# Altium schematic sheet PositionMeasurement.SchDoc: MSE - CSYEI : Position measurement
size A4; Author: BKO + PKI; SheetNumber: 6; SheetTotal: 8; SVN: OUI; Version: 2.1; NoProject: <no>; TitleProject: <project>
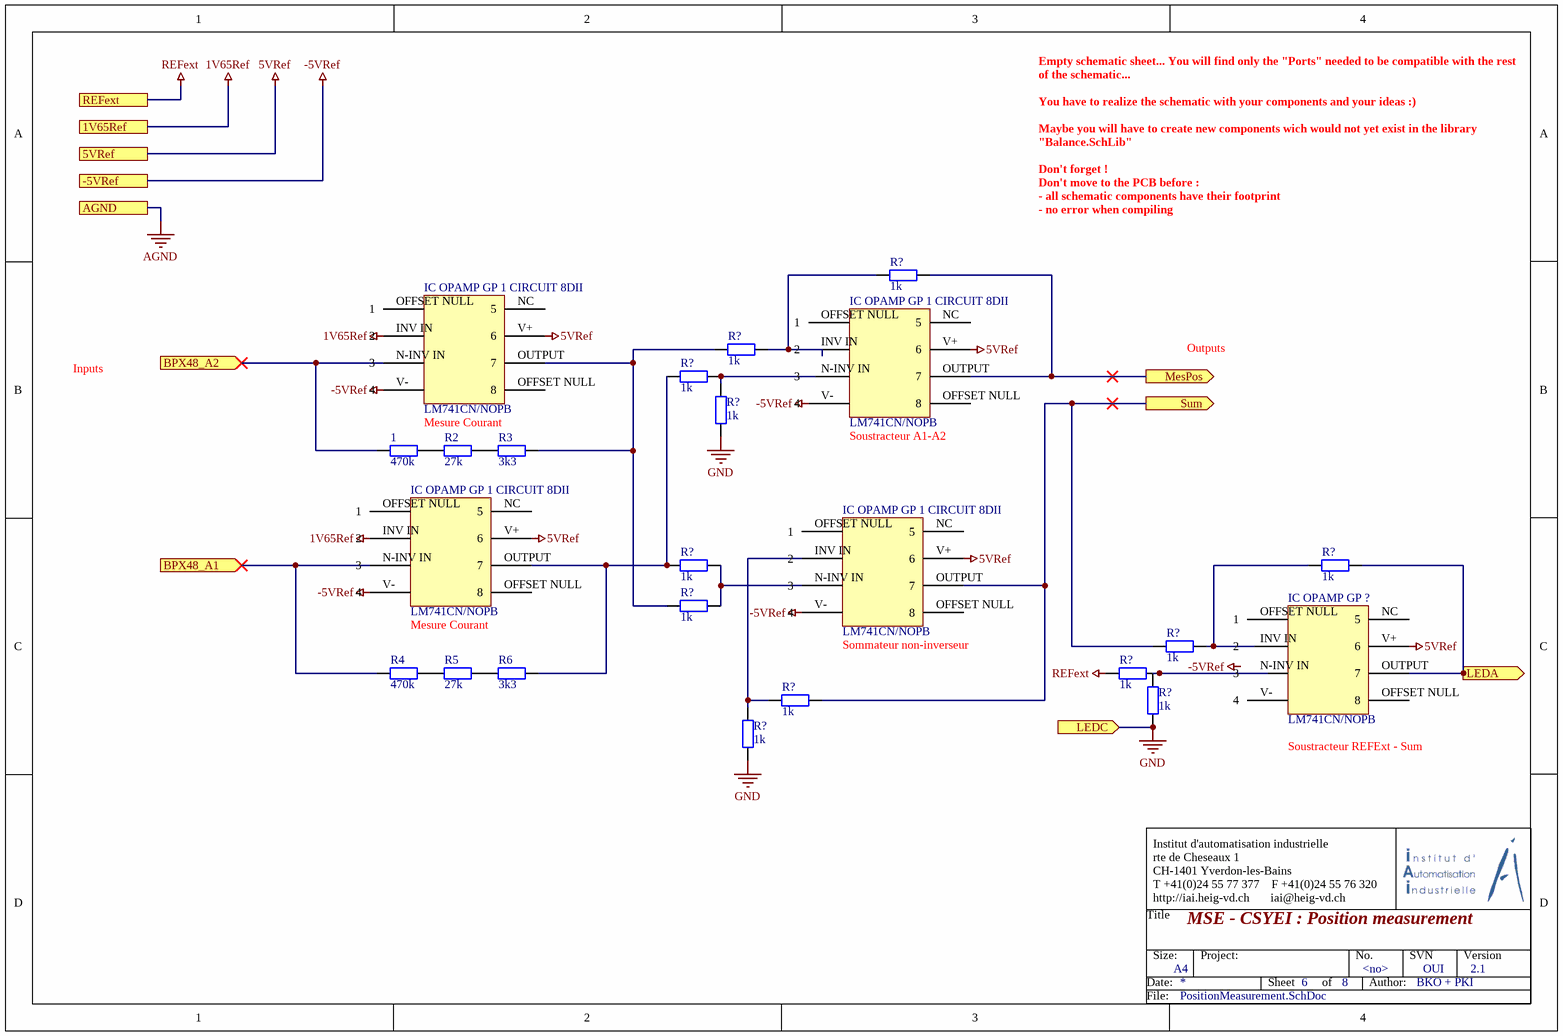
[diagram p0: PositionMeasurement.SchDoc]

## Parts
(Parts that share a designator on the sheet are numbered #1, #2 ... from top to bottom, then left to right.)
1  470k  [RESC2012N]
IC_OPAMP_GP_1_CIRCUIT_8DII#1  LM741CN/NOPB
IC_OPAMP_GP_1_CIRCUIT_8DII#2  LM741CN/NOPB
IC_OPAMP_GP_1_CIRCUIT_8DII#3  LM741CN/NOPB
IC_OPAMP_GP_1_CIRCUIT_8DII#4  LM741CN/NOPB
IC_OPAMP_GP_?  LM741CN/NOPB
R2  27k  [RESC2012N]
R3  3k3  [RESC2012N]
R4  470k  [RESC2012N]
R5  27k  [RESC2012N]
R6  3k3  [RESC2012N]
R?#1  1k  [RESC2012N]
R?#2  1k  [RESC2012N]
R?#3  1k  [RESC2012N]
R?#4  1k  [RESC2012N]
R?#5  1k  [RESC2012N]
R?#6  1k  [RESC2012N]
R?#7  1k  [RESC2012N]
R?#8  1k  [RESC2012N]
R?#9  1k  [RESC2012N]
R?#10  1k  [RESC2012N]
R?#11  1k  [RESC2012N]
R?#12  1k  [RESC2012N]

## Ports
1V65Ref, 5VRef, -5VRef, AGND, BPX48_A1 (in), BPX48_A2 (in), LEDA (out), LEDC (in), MesPos (out), REFext, Sum (out)

## Nets
1V65Ref: port 1V65Ref
5VRef: IC_OPAMP_GP_1_CIRCUIT_8DII#1.V+(6) IC_OPAMP_GP_1_CIRCUIT_8DII#2.V+(6) IC_OPAMP_GP_1_CIRCUIT_8DII#3.V+(6) IC_OPAMP_GP_1_CIRCUIT_8DII#4.V+(6) IC_OPAMP_GP_?.V+(6) ; port 5VRef
-5VRef: port -5VRef
AGND: port AGND
GND: R?#4.1 R?#11.1 R?#12.1 ; port LEDC
REFext: R?#9.1 ; port REFext
BPX48_A1: R4.1 ; port BPX48_A1
BPX48_A2: 1.1 ; port BPX48_A2
LEDA: IC_OPAMP_GP_?.OUTPUT(7) R?#5.2 ; port LEDA
MesPos: IC_OPAMP_GP_1_CIRCUIT_8DII#2.OUTPUT(7) R?#1.2 ; port MesPos
Sum: IC_OPAMP_GP_1_CIRCUIT_8DII#4.OUTPUT(7) R?#8.1 R?#10.1 ; port Sum
Net1_2: 1.2 R2.1
NetIC_OPAMP_GP_1_CIRCUIT_8DII#1_OUTPUT: IC_OPAMP_GP_1_CIRCUIT_8DII#1.OUTPUT(7) R3.2 R?#2.1 R?#7.2
NetIC_OPAMP_GP_1_CIRCUIT_8DII#3_OUTPUT: IC_OPAMP_GP_1_CIRCUIT_8DII#3.OUTPUT(7) R6.2 R?#3.1 R?#6.2
NetR2_2: R2.2 R3.1
NetR4_2: R4.2 R5.1
NetR5_2: R5.2 R6.1
NetR?#1_1: R?#1.1 R?#2.2
NetR?#3_2: R?#3.2 R?#4.2
NetR?#5_1: R?#5.1 R?#8.2
NetR?#6_1: R?#6.1 R?#7.1
NetR?#9_2: R?#9.2 R?#11.2
NetR?#10_2: R?#10.2 R?#12.2

Not connected (* = marked no-connect by the designer): IC_OPAMP_GP_1_CIRCUIT_8DII#1 INV IN(2) N-INV IN(3) NC(5) OFFSET NULL(1) V-(4); IC_OPAMP_GP_1_CIRCUIT_8DII#2 INV IN(2) N-INV IN(3) NC(5) OFFSET NULL(1) V-(4); IC_OPAMP_GP_1_CIRCUIT_8DII#3 INV IN(2) N-INV IN(3) NC(5) OFFSET NULL(1) V-(4); IC_OPAMP_GP_1_CIRCUIT_8DII#4 INV IN(2) N-INV IN(3) NC(5) OFFSET NULL(1) V-(4); IC_OPAMP_GP_? INV IN(2) N-INV IN(3) NC(5) OFFSET NULL(1) V-(4)

## Notes on the sheet
- Empty schematic sheet... You will find only the "Ports" needed to be compatible with the rest of the schematic...
  You have to realize the schematic with your components and your ideas :)
  Maybe you will have to create new components wich would not yet exist in the library "Balance.SchLib"
  Don't forget !
  Don't move to the PCB before :
  - all schematic components have their footprint
  - no error when compiling
- Inputs
- Outputs
- Mesure Courant
- (near IC_OPAMP_GP_1_CIRCUIT_8DII#2) Soustracteur A1-A2
- (near IC_OPAMP_GP_1_CIRCUIT_8DII#4) Sommateur non-inverseur
- (near IC_OPAMP_GP_?) Soustracteur REFExt - Sum
- Labels drawn without touching a wire or pin: 1V65Ref, -5VRef
- Title
- Institut d'automatisation industrielle
  rte de Cheseaux 1
  CH-1401 Yverdon-les-Bains
  T +41(0)24 55 77 377    F +41(0)24 55 76 320
  http://iai.heig-vd.ch       iai@heig-vd.ch
- Date:
- Size:
- A4
- Project:
- Sheet
- of
- No.
- Author:
- SVN
- Version
- File:

## Library data of the parts
1 R4 = Res_470k: Resistor; Value: 470k; Supplier 1: Digi-Key; Supplier Part Number 1: 311-470KCRCT-ND
IC_OPAMP_GP_1_CIRCUIT_8DII#1-IC_OPAMP_GP_1_CIRCUIT_8DII#4 IC_OPAMP_GP_? = LM741CN/NOPB: IC OPAMP GP 1 CIRCUIT 8DII; Supplier 1: Digi-Key; Supplier Part Number 1: LM741CNNS/NOPB-ND
R2 R5 = Res_27k: Resistor; Value: 27k; Supplier 1: Digi-Key; Supplier Part Number 1: 311-27.0KCRCT-ND
R3 R6 = Res_3k3: Resistor; Value: 3k3; Supplier 1: Digi-Key; Supplier Part Number 1: 311-3.30KCRCT-ND
R?#1-R?#12 = Res_1k: Resistor; Value: 1k; Supplier 1: Digi-Key; Supplier Part Number 1: 311-1.00KCRCT-ND